# Altium project AUAV-X1_R1.PrjPCB
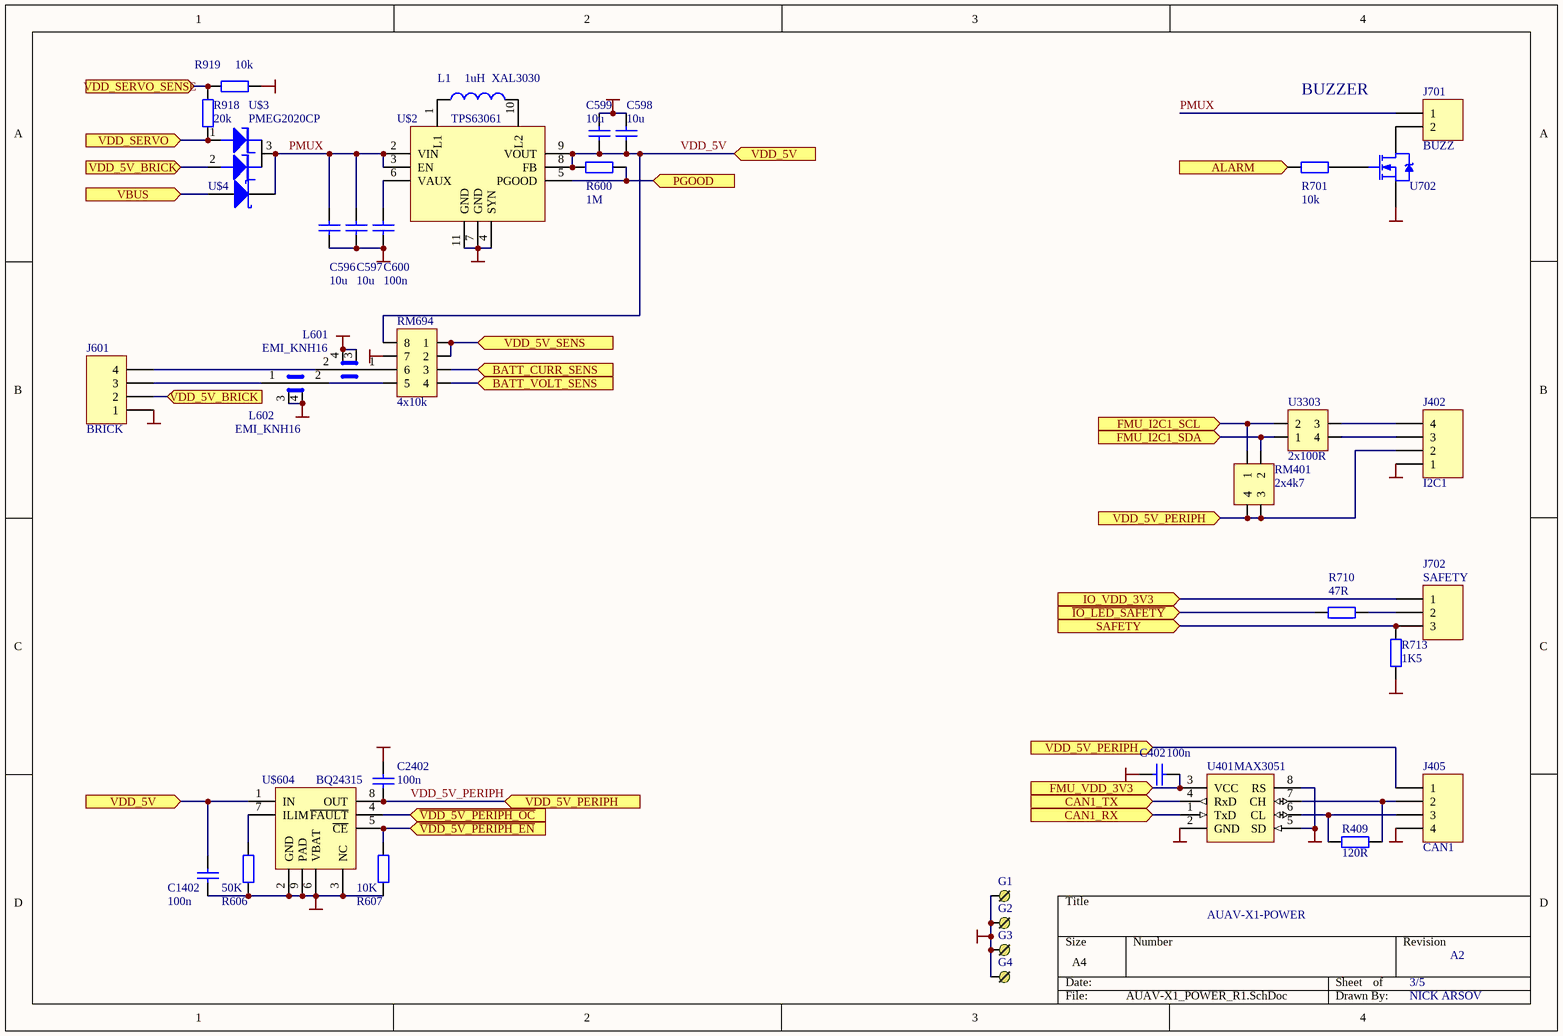
[diagram p0: AUAV-X1_POWER_R1.SchDoc]
3 sheets, 88 parts. Net scope: flat (ports and power ports of the same name join across sheets).
Board file: AUAV-X1_R1.PcbDoc
Sheets:
  AUAV-X1_POWER_R1.SchDoc
  AUAV-X1_IOSOC_R1.SchDoc
  AUAV-X1_SENSORS_R1.SchDoc

## Sheet AUAV-X1_POWER_R1.SchDoc
size A4; PageSetup: Record=PageOptions|CenterHorizontal=True|CenterVertical=True|PrintScale=0.97|XCorrection=1.00|YCorrection=1.00|PrintKind=2|BorderSize=5000000|LeftOffset=0|BottomOffset=0|Orientation=2|PaperLength=1000|PaperWidth=1000|Scale=100|PaperSource=267|PrintQuality=-4|MediaType=1|DitherType=1|PaperKind=A4|PrintScaleMode=1

### Parts
C402  100n  [0402A]
C596  10u  [0805A]
C597  10u  [0805A]
C598  10u  [0805A]
C599  10u  [0805A]
C600  100n  [0402A]
C1402  100n  [0402A]
C2402  100n  [0402A]
G1  PLUG  [SMT_PAD_ROUND]  (value not drawn)
G2  PLUG  [SMT_PAD_ROUND]  (value not drawn)
G3  PLUG  [SMT_PAD_ROUND]  (value not drawn)
G4  PLUG  [SMT_PAD_ROUND]  (value not drawn)
J402  I2C1  [HDR1X4]
J405  CAN1  [HDR1X4]
J601  BRICK  [HDR1X4]
J701  BUZZ  [HDR1X2]
J702  SAFETY  [HDR1X3]
L1  XAL3030  value 1uH  [XAL4040]
L601  EMI_KNH16  [EMI_KNH16_0603]
L602  EMI_KNH16  [EMI_KNH16_0603]
R409  120R  [0603A]
R600  1M  [0402A]
R606  50K  [0402A]
R607  10K  [0402A]
R701  10k  [0402A]
R710  47R  [0402A]
R713  1K5  [0402A]
R918  20k  [0402A]
R919  10k  [0402A]
RM401  2x4k7  [RM2_0804]
RM694  4x10k  [RM4_0804]
U401  MAX3051  [SOT-23-8]
U702  ZXMN2F34MA  [2N7002-SOT323]  (value not drawn)
U3303  2x100R  [RM2_0804]
U$2  TPS63061  [TPS63061]
U$3  PMEG2020CP  [pmeg2020cp]
U$4  D Schottky  [SOD323F]  (value not drawn)
U$604  BQ24315  [BQ24315]

### Ports
ALARM, BATT_CURR_SENS, BATT_VOLT_SENS, CAN1_RX, CAN1_TX, FMU_I2C1_SCL, FMU_I2C1_SDA, FMU_VDD_3V3, IO_VDD_3V3, PGOOD, SAFETY, VBUS, VDD_5V, VDD_5V_BRICK, VDD_5V_PERIPH, VDD_5V_SENS, VDD_SERVO, VDD_SERVO_SENSE, ~{IO_LED_SAFETY}, ~{VDD_5V_PERIPH_EN}, ~{VDD_5V_PERIPH_OC}

### Nets
GND: C402.1 C596.1 C597.1 C598.1 C599.1 C600.1 C1402.1 C2402.1 G1.1 G2.1 G3.1 G4.1 J402.1 J405.4 J601.1 L601.3(G) L601.4(G) L602.3(G) L602.4(G) R606.1 R607.1 R713.2 R919.2 RM694.7 U401.2(GND) U401.5(SD) U401.8(RS) U702.2(S) U$2.4(SYN) U$2.7(GND) U$2.11(GND) U$604.2(GND) U$604.3(NC) U$604.6(VBAT) U$604.9(PAD)
IO_VDD_3V3: J702.1 ; port IO_VDD_3V3
PMUX: C596.2 C597.2 J701.1 U$2.2(VIN) U$2.3(EN) U$3.3 U$4.2(K)
VDD_5V: C598.2 C599.2 C1402.2 R600.1 RM694.8 U$2.8(FB) U$2.9(VOUT) U$604.1(IN) ; port VDD_5V
VDD_5V_PERIPH: C2402.2 J402.2 J405.1 RM401.3 RM401.4 U$604.8(OUT) ; port VDD_5V_PERIPH
VDD_SERVO: R918.2 U$3.1 ; port VDD_SERVO
NetC402_2: C402.2 U401.3(VCC) ; port FMU_VDD_3V3
NetC600_2: C600.2 U$2.6(VAUX)
NetJ402_3: J402.3 U3303.4
NetJ402_4: J402.4 U3303.3
NetJ405_2: J405.2 R409.1 U401.7(CH)
NetJ405_3: J405.3 R409.2 U401.6(CL)
NetJ601_2: J601.2 U$3.2 ; port VDD_5V_BRICK
NetJ601_3: J601.3 L602.1(L1)
NetJ601_4: J601.4 L601.2(L2)
NetJ701_2: J701.2 U702.1(D)
NetJ702_2: J702.2 R710.1
NetJ702_3: J702.3 R713.1 ; port SAFETY
NetL1_1: L1.1 U$2.1(L1)
NetL1_2: L1.2 U$2.10(L2)
NetL601_1: L601.1(L1) RM694.6
NetL602_2: L602.2(L2) RM694.5
NetR600_2: R600.2 U$2.5(PGOOD) ; port PGOOD
NetR606_2: R606.2 U$604.7(ILIM)
NetR607_2: R607.2 U$604.5(~{CE}) ; port ~{VDD_5V_PERIPH_EN}
NetR701_1: R701.1 ; port ALARM
NetR701_2: R701.2 U702.3(G)
NetR710_2: R710.2 ; port ~{IO_LED_SAFETY}
NetR918_1: R918.1 R919.1 ; port VDD_SERVO_SENSE
NetRM401_1: RM401.1 U3303.2 ; port FMU_I2C1_SCL
NetRM401_2: RM401.2 U3303.1 ; port FMU_I2C1_SDA
NetRM694_1: RM694.1 RM694.2 ; port VDD_5V_SENS
NetRM694_3: RM694.3 ; port BATT_CURR_SENS
NetRM694_4: RM694.4 ; port BATT_VOLT_SENS
NetU401_1: U401.1(TxD) ; port CAN1_RX
NetU401_4: U401.4(RxD) ; port CAN1_TX
NetU$4_1: U$4.1(A) ; port VBUS
NetU$604_4: U$604.4(~{FAULT}) ; port ~{VDD_5V_PERIPH_OC}

### Notes on the sheet
- BUZZER
- AUAV-X1-POWER
- 3/5
- A2
- NICK ARSOV

### Library data of the parts
C402 C596-C600 C1402 C2402 = Cap: Capacitor; Value: 100pF; Published: 8-Jun-2000; LatestRevisionDate: 17-Jul-2002; LatestRevisionNote: Re-released for DXP Platform.; PackageReference: RAD-0.3; Publisher: Altium Limited
J402 J405 J601 = Header 4: Header, 4-Pin; LatestRevisionDate: 17-Jul-2002; LatestRevisionNote: Re-released for DXP Platform.; Publisher: Altium Limited
J701 = Header 2: Header, 2-Pin; LatestRevisionDate: 17-Jul-2002; LatestRevisionNote: Re-released for DXP Platform.; Publisher: Altium Limited
J702 = Header 3: Header, 3-Pin; LatestRevisionDate: 17-Jul-2002; LatestRevisionNote: Re-released for DXP Platform.; Publisher: Altium Limited
L1 = Inductor: Code_IEC: 1005; Published: 8-Jun-2000; LatestRevisionDate: 17-Jul-2002; LatestRevisionNote: Re-released for DXP Platform.; PackageReference: 0402-A; Publisher: Altium Limited; Code_JEITA: 0402
L601 L602 = EMI_KNH10
R409 R600 R606 R607 R701 R710 R713 R918 R919 = Res2: Resistor; Value: 1K; Published: 8-Jun-2000; LatestRevisionDate: 17-Jul-2002; LatestRevisionNote: Re-released for DXP Platform.; PackageReference: AXIAL-0.4; Publisher: Altium Limited
RM401 U3303 = RES_SMD_2
RM694 = RES_SMD_4
U702 = NMOS-2: N-Channel Power MOSFET; Note: Pin 2 is electrically connected to pin 4.; Published: 8-Jun-2000; LatestRevisionDate: 17-Jul-2002; LatestRevisionNote: Re-released for DXP Platform.; DatasheetDocument: PD-9.814; PackageReference: TO-220AB; Publisher: Altium Limited; Code_JEDEC: TO-220-AB; ComponentLink1Description: Manufacturer Link; ComponentLink1URL: http://www.irf.com/
U$4 = D Schottky: Schottky Diode; Published: 8-Jun-2000; LatestRevisionDate: 17-Jul-2002; LatestRevisionNote: Re-released for DXP Platform.; PackageReference: SMB; Publisher: Altium Limited; Code_JEDEC: DO-214-AA

## Sheet AUAV-X1_IOSOC_R1.SchDoc
size A4; PageSetup: Record=PageOptions|CenterHorizontal=True|CenterVertical=True|PrintScale=0.97|XCorrection=1.00|YCorrection=1.00|PrintKind=2|BorderSize=5000000|LeftOffset=0|BottomOffset=0|Orientation=2|PaperLength=1000|PaperWidth=1000|Scale=100|PaperSource=267|PrintQuality=-4|MediaType=1|DitherType=1|PaperKind=A4|PrintScaleMode=1
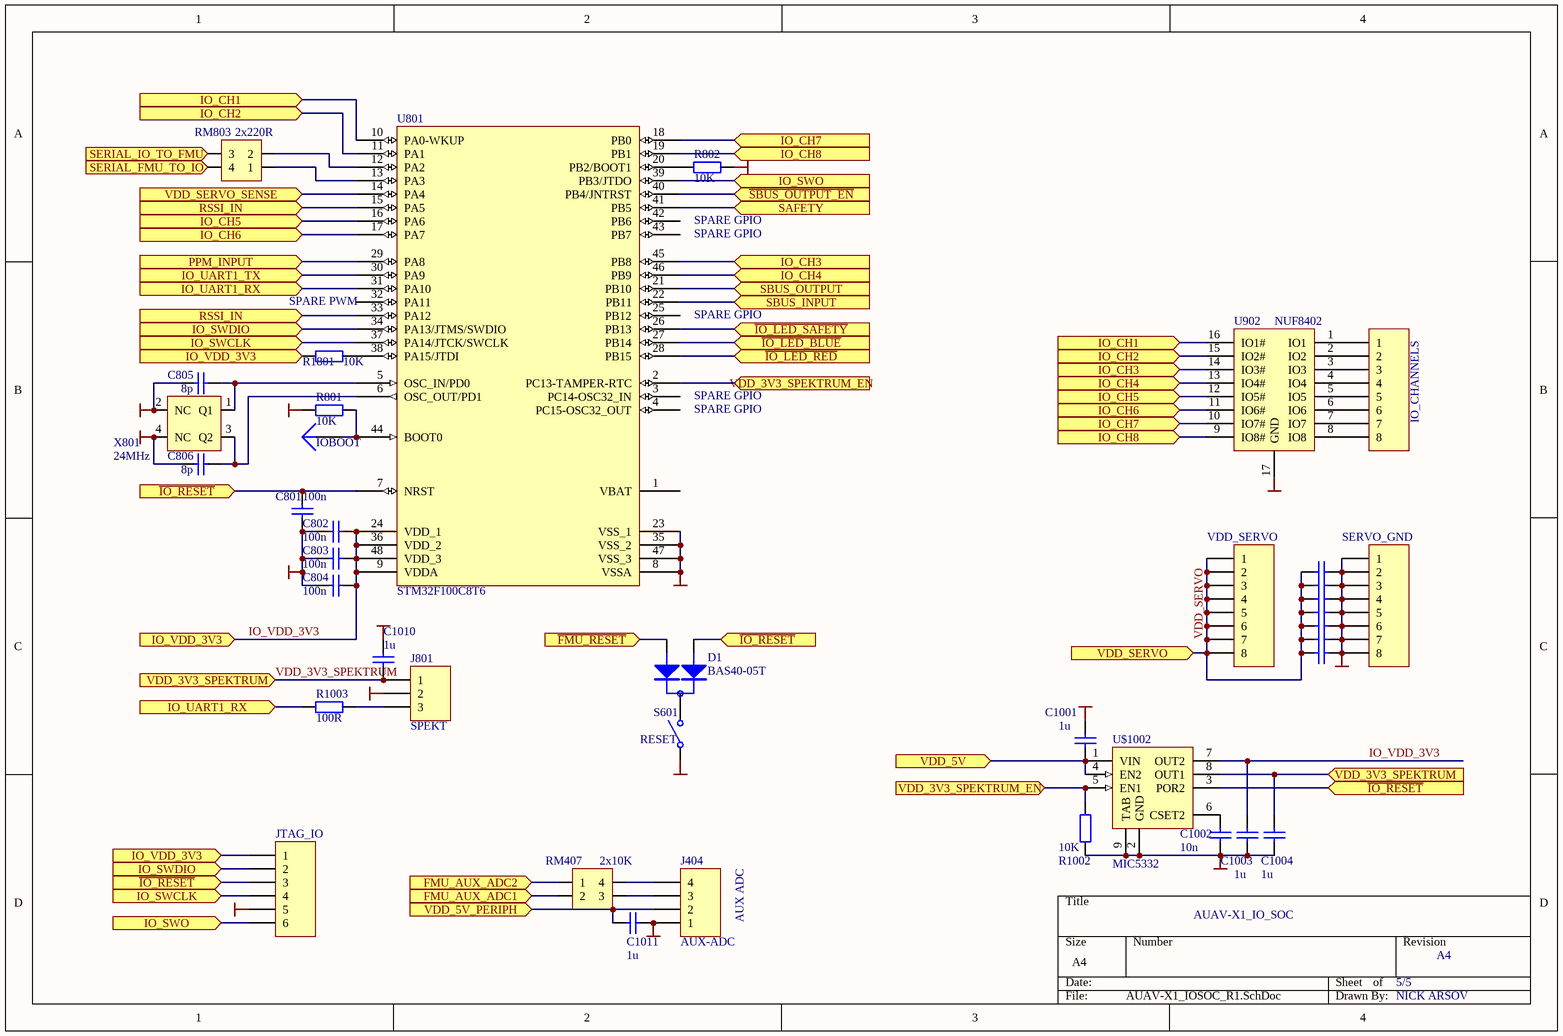
[diagram p1: AUAV-X1_IOSOC_R1.SchDoc]

### Parts
C801  100n  [0402A]
C802  100n  [0402A]
C803  100n  [0402A]
C804  100n  [0402A]
C805  8p  [0402A]
C806  8p  [0402A]
C1001  1u  [0402A]
C1002  10n  [0402A]
C1003  1u  [0402A]
C1004  1u  [0402A]
C1010  1u  [0402A]
C1011  1u  [0402A]
C3001  100n  [0402A]  (value not drawn)
C3002  100n  [0402A]  (value not drawn)
C3003  100n  [0402A]  (value not drawn)
C3004  100n  [0402A]  (value not drawn)
C3005  100n  [0402A]  (value not drawn)
C3006  100n  [0402A]  (value not drawn)
C3007  100n  [0402A]  (value not drawn)
D1  BAS40-05T  [SOT-523]
IO_CHANNELS  Header 8  [HDR1X8]  (value not drawn)
IOBOOT  Plug  [PAD1]  (value not drawn)
J404  AUX-ADC  [HDR1X4]
J801  SPEKT  [hdr1x3]
JTAG_IO  Header 6  [JTAG_TC2030]  (value not drawn)
R801  10K  [0402A]
R802  10K  [0402A]
R1002  10K  [0402A]
R1003  100R  [0402A]
R1801  10K  [0402A]
RM407  2x10K  [RM2_0804]
RM803  2x220R  [RM2_0804]
S601  RESET  [OMRON_B3U_V]
SERVO_GND  Header 8  [HDR1X8]  (value not drawn)
U801  STM32F100C8T6  [LQFP48_L]
U902  NUF8402  [NUF8402]
U$1002  MIC5332  [MIC5332]
VDD_SERVO  Header 8  [HDR1X8]  (value not drawn)
X801  24MHz  [Crystal_2.5x2]

### Ports
FMU_AUX_ADC1, FMU_AUX_ADC2, IO_CH1, IO_CH2, IO_CH3, IO_CH4, IO_CH5, IO_CH6, IO_CH7, IO_CH8, IO_SWCLK, IO_SWDIO, IO_SWO, IO_UART1_RX, IO_UART1_TX, IO_VDD_3V3, PPM_INPUT, RSSI_IN, SAFETY, SBUS_INPUT, SBUS_OUTPUT, SERIAL_FMU_TO_IO, SERIAL_IO_TO_FMU, VDD_3V3_SPEKTRUM, VDD_3V3_SPEKTRUM_EN, VDD_5V, VDD_5V_PERIPH, VDD_SERVO, VDD_SERVO_SENSE, ~{FMU_RESET}, ~{IO_LED_BLUE}, ~{IO_LED_RED}, ~{IO_LED_SAFETY}, ~{IO_RESET}, ~{SBUS_OUTPUT_EN}

### Nets
GND: C801.1 C802.1 C803.1 C804.1 C805.1 C806.1 C1001.2 C1002.1 C1003.1 C1004.1 C1010.2 C1011.2 C3001.1 C3002.1 C3003.1 C3004.1 C3005.1 C3006.1 C3007.1 J404.1 J801.2 JTAG_IO.5 R801.1 R802.2 R1002.1 S601.1(COMMON) SERVO_GND.1 SERVO_GND.2 SERVO_GND.3 SERVO_GND.4 SERVO_GND.5 SERVO_GND.6 SERVO_GND.7 SERVO_GND.8 U801.8(VSSA) U801.23(VSS_1) U801.35(VSS_2) U801.47(VSS_3) U902.17(GND) U$1002.2(GND) U$1002.9(TAB) X801.2(NC) X801.4(NC)
IO_VDD_3V3: C802.2 C803.2 C804.2 C1003.2 JTAG_IO.1 R1801.1 U801.9(VDDA) U801.24(VDD_1) U801.36(VDD_2) U801.48(VDD_3) U$1002.7(OUT2) ; port IO_VDD_3V3
VDD_3V3_SPEKTRUM: C1004.2 C1010.1 J801.1 U$1002.8(OUT1) ; port VDD_3V3_SPEKTRUM
VDD_5V: C1001.1 U$1002.1(VIN) U$1002.4(EN2) ; port VDD_5V
VDD_5V_PERIPH: C1011.1 J404.2 ; port VDD_5V_PERIPH
VDD_SERVO: C3001.2 C3002.2 C3003.2 C3004.2 C3005.2 C3006.2 C3007.2 VDD_SERVO.1 VDD_SERVO.2 VDD_SERVO.3 VDD_SERVO.4 VDD_SERVO.5 VDD_SERVO.6 VDD_SERVO.7 VDD_SERVO.8 ; port VDD_SERVO
NetC801_2: C801.2 D1.2 JTAG_IO.3 U801.7(NRST) U$1002.3(POR2) ; port ~{IO_RESET}
NetC805_2: C805.2 U801.5(OSC_IN/PD0) X801.1(Q1)
NetC806_2: C806.2 U801.6(OSC_OUT/PD1) X801.3(Q2)
NetC1002_2: C1002.2 U$1002.6(CSET2)
NetD1_1: D1.1 ; port ~{FMU_RESET}
NetD1_3: D1.3 S601.2(NO)
NetIO_CHANNELS_1: IO_CHANNELS.1 U902.1(IO1)
NetIO_CHANNELS_2: IO_CHANNELS.2 U902.2(IO2)
NetIO_CHANNELS_3: IO_CHANNELS.3 U902.3(IO3)
NetIO_CHANNELS_4: IO_CHANNELS.4 U902.4(IO4)
NetIO_CHANNELS_5: IO_CHANNELS.5 U902.5(IO5)
NetIO_CHANNELS_6: IO_CHANNELS.6 U902.6(IO6)
NetIO_CHANNELS_7: IO_CHANNELS.7 U902.7(IO7)
NetIO_CHANNELS_8: IO_CHANNELS.8 U902.8(IO8)
NetIOBOOT_1: IOBOOT.1 R801.2 U801.44(BOOT0)
NetJ404_3: J404.3 RM407.3
NetJ404_4: J404.4 RM407.4
NetJ702_3: U801.41(PB5) ; port SAFETY
NetJ801_3: J801.3 R1003.1
NetJTAG_IO_2: JTAG_IO.2 U801.34(PA13/JTMS/SWDIO) ; port IO_SWDIO
NetJTAG_IO_4: JTAG_IO.4 U801.37(PA14/JTCK/SWCLK) ; port IO_SWCLK
NetJTAG_IO_6: JTAG_IO.6 U801.39(PB3/JTDO) ; port IO_SWO
NetR703_2: U801.28(PB15) ; port ~{IO_LED_RED}
NetR705_2: U801.27(PB14) ; port ~{IO_LED_BLUE}
NetR710_2: U801.26(PB13) ; port ~{IO_LED_SAFETY}
NetR802_1: R802.1 U801.20(PB2/BOOT1)
NetR918_1: U801.14(PA4) ; port VDD_SERVO_SENSE
NetR1002_2: R1002.2 U801.2(PC13-TAMPER-RTC) U$1002.5(EN1) ; port VDD_3V3_SPEKTRUM_EN
NetR1003_2: R1003.2 U801.31(PA10) ; port IO_UART1_RX
NetR1801_2: R1801.2 U801.38(PA15/JTDI)
NetRM407_1: RM407.1 ; port FMU_AUX_ADC2
NetRM407_2: RM407.2 ; port FMU_AUX_ADC1
NetRM803_1: RM803.1 U801.13(PA3)
NetRM803_2: RM803.2 U801.12(PA2)
NetRM803_3: RM803.3 ; port SERIAL_IO_TO_FMU
NetRM803_4: RM803.4 ; port SERIAL_FMU_TO_IO
NetU801_10: U801.10(PA0-WKUP) U902.16(IO1#) ; port IO_CH1
NetU801_11: U801.11(PA1) U902.15(IO2#) ; port IO_CH2
NetU801_15: U801.15(PA5) U801.33(PA12) ; port RSSI_IN
NetU801_16: U801.16(PA6) U902.12(IO5#) ; port IO_CH5
NetU801_17: U801.17(PA7) U902.11(IO6#) ; port IO_CH6
NetU801_18: U801.18(PB0) U902.10(IO7#) ; port IO_CH7
NetU801_19: U801.19(PB1) U902.9(IO8#) ; port IO_CH8
NetU801_21: U801.21(PB10) ; port SBUS_OUTPUT
NetU801_22: U801.22(PB11) ; port SBUS_INPUT
NetU801_29: U801.29(PA8) ; port PPM_INPUT
NetU801_30: U801.30(PA9) ; port IO_UART1_TX
NetU801_40: U801.40(PB4/JNTRST) ; port ~{SBUS_OUTPUT_EN}
NetU801_45: U801.45(PB8) U902.14(IO3#) ; port IO_CH3
NetU801_46: U801.46(PB9) U902.13(IO4#) ; port IO_CH4

Not connected (* = marked no-connect by the designer): U801 1(VBAT) 3(PC14-OSC32_IN) 4(PC15-OSC32_OUT) 25(PB12) 32(PA11) 42(PB6) 43(PB7)

### Notes on the sheet
- SPARE GPIO
- SPARE PWM
- AUX ADC
- AUAV-X1_IO_SOC
- 5/5
- A4
- NICK ARSOV

### Library data of the parts
C801-C806 C1001-C1004 C1010 C1011 C3001-C3007 = Cap: Capacitor; Value: 100pF; Published: 8-Jun-2000; LatestRevisionDate: 17-Jul-2002; LatestRevisionNote: Re-released for DXP Platform.; PackageReference: RAD-0.3; Publisher: Altium Limited
D1 = D-DIODE
IO_CHANNELS SERVO_GND VDD_SERVO = Header 8: Header, 8-Pin; LatestRevisionDate: 17-Jul-2002; LatestRevisionNote: Re-released for DXP Platform.; Publisher: Altium Limited
J404 = Header 4: Header, 4-Pin; LatestRevisionDate: 17-Jul-2002; LatestRevisionNote: Re-released for DXP Platform.; Publisher: Altium Limited
J801 = Header 3: Header, 3-Pin; LatestRevisionDate: 17-Jul-2002; LatestRevisionNote: Re-released for DXP Platform.; Publisher: Altium Limited
JTAG_IO = Header 6: Header, 6-Pin; LatestRevisionDate: 17-Jul-2002; LatestRevisionNote: Re-released for DXP Platform.; Publisher: Altium Limited
R801 R802 R1002 R1003 R1801 = Res2: Resistor; Value: 1K; Published: 8-Jun-2000; LatestRevisionDate: 17-Jul-2002; LatestRevisionNote: Re-released for DXP Platform.; PackageReference: AXIAL-0.4; Publisher: Altium Limited
RM407 RM803 = RES_SMD_2
S601 = SW-SPST: Single-Pole, Single-Throw Switch; Published: 24-Mar-1999; LatestRevisionDate: 17-Jul-2002; LatestRevisionNote: Re-released for DXP Platform.; PackageReference: SPST-2; Publisher: Altium Limited
U801 = STM32F101C6T6: STM32 ARM-based 32-bit MCU with 32 Kbytes Flash, 48-pin LQFP, Industrial Temperature; Published: 30-May-2008; DatasheetVersion: rev6, Mar-2008; PackageVersion: Mar-2008; PackageReference: LQFP48; Publisher: Altium Limited; PackageDescription: 48-Pin Low-Profile Quad Flat Pack, 7 x 7 mm Body, 0.5 mm Pitch (LQFP48); ComponentLink1Description: Manufacturer Link; ComponentLink1URL: www.st.com/stm32; ComponentLink2Description: Datasheet; ComponentLink2URL: http://www.st.com/stonline/products/literature/ds/13586.pdf
X801 = Crystal_4pin
IOBOOT = Plug: LatestRevisionDate: 17-Jul-2002; LatestRevisionNote: Re-released for DXP Platform.; Publisher: Altium Limited

## Sheet AUAV-X1_SENSORS_R1.SchDoc
size A4; PageSetup: Record=PageOptions|CenterHorizontal=True|CenterVertical=True|PrintScale=0.97|XCorrection=1.00|YCorrection=1.00|PrintKind=2|BorderSize=5000000|LeftOffset=0|BottomOffset=0|Orientation=2|PaperLength=1000|PaperWidth=1000|Scale=100|PaperSource=267|PrintQuality=-4|MediaType=1|DitherType=1|PaperKind=A4|PrintScaleMode=1
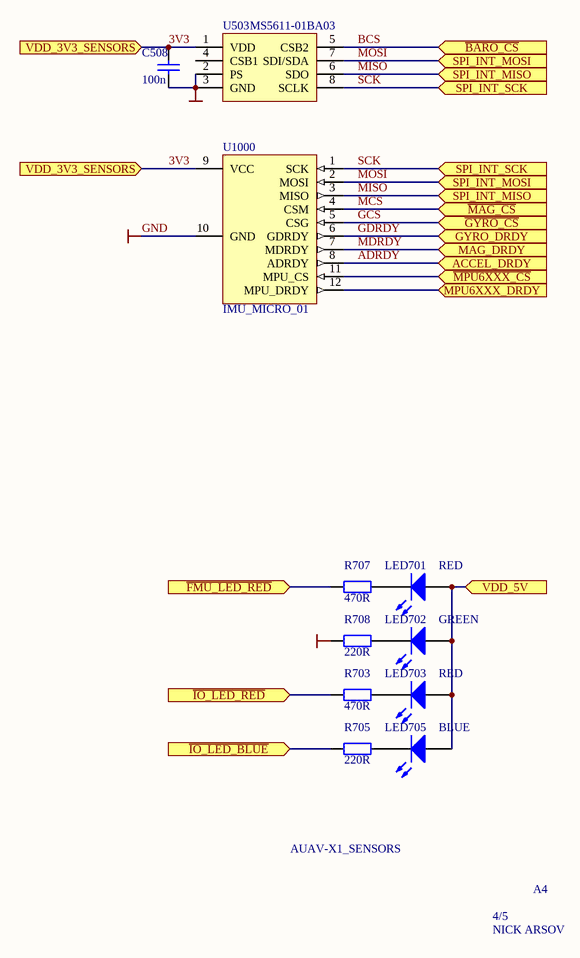
[diagram p2: AUAV-X1_SENSORS_R1.SchDoc]

### Parts
C508  100n  [0402A]
LED701  RED  [0603A]
LED702  GREEN  [0603A]
LED703  RED  [0603A]
LED705  BLUE  [0603A]
R703  470R  [0603A]
R705  220R  [0603A]
R707  470R  [0603A]
R708  220R  [0603A]
U503  MS5611-01BA03  [MS5611]
U1000  IMU_MICRO_01  [MicroIMU_01]

### Ports
ACCEL_DRDY, GYRO_DRDY, MAG_DRDY, MPU6XXX_DRDY, SPI_INT_MISO, SPI_INT_MOSI, SPI_INT_SCK, VDD_3V3_SENSORS, VDD_5V, ~{BARO_CS}, ~{FMU_LED_RED}, ~{GYRO_CS}, ~{IO_LED_BLUE}, ~{IO_LED_RED}, ~{MAG_CS}, ~{MPU6XXX_CS}

### Nets
GND: C508.1 R708.2 U503.2(PS) U503.3(GND) U1000.10(GND)
3V3: C508.2 U503.1(VDD) U1000.9(VCC) ; port VDD_3V3_SENSORS
ADRDY: U1000.8(ADRDY) ; port ACCEL_DRDY
BCS: U503.5(CSB2) ; port ~{BARO_CS}
GCS: U1000.5(CSG) ; port ~{GYRO_CS}
GDRDY: U1000.6(GDRDY) ; port GYRO_DRDY
MCS: U1000.4(CSM) ; port ~{MAG_CS}
MDRDY: U1000.7(MDRDY) ; port MAG_DRDY
MISO: U503.6(SDO) U1000.3(MISO) ; port SPI_INT_MISO
MOSI: U503.7(SDI/SDA) U1000.2(MOSI) ; port SPI_INT_MOSI
SCK: U503.8(SCLK) U1000.1(SCK) ; port SPI_INT_SCK
VDD_5V: LED701.1(A) LED702.1(A) LED703.1(A) LED705.1(A) ; port VDD_5V
NetLED701_2: LED701.2(K) R707.1
NetLED702_2: LED702.2(K) R708.1
NetLED703_2: LED703.2(K) R703.1
NetLED705_2: LED705.2(K) R705.1
NetR703_2: R703.2 ; port ~{IO_LED_RED}
NetR705_2: R705.2 ; port ~{IO_LED_BLUE}
NetR707_2: R707.2 ; port ~{FMU_LED_RED}
NetU1000_11: U1000.11(MPU_CS) ; port ~{MPU6XXX_CS}
NetU1000_12: U1000.12(MPU_DRDY) ; port MPU6XXX_DRDY

Not connected (* = marked no-connect by the designer): U503 4(CSB1)

### Notes on the sheet
- AUAV-X1_SENSORS
- 4/5
- A4
- NICK ARSOV

### Library data of the parts
C508 = Cap: Capacitor; Value: 100pF; Published: 8-Jun-2000; LatestRevisionDate: 17-Jul-2002; LatestRevisionNote: Re-released for DXP Platform.; PackageReference: RAD-0.3; Publisher: Altium Limited
LED701-LED703 LED705 = LED0: Typical INFRARED GaAs LED; Published: 8-Jun-2000; LatestRevisionDate: 08-Jul-2005; LatestRevisionNote: Mech Layer 1 removed.; PackageReference: LED-0; Publisher: Altium Limited
R703 R705 R707 R708 = Res2: Resistor; Value: 1K; Published: 8-Jun-2000; LatestRevisionDate: 17-Jul-2002; LatestRevisionNote: Re-released for DXP Platform.; PackageReference: AXIAL-0.4; Publisher: Altium Limited

## Nets that join several sheets
GND: AUAV-X1_POWER_R1 (35 pins), AUAV-X1_IOSOC_R1 (43 pins), AUAV-X1_SENSORS_R1 (5 pins)
IO_VDD_3V3: AUAV-X1_POWER_R1 (J702.1), AUAV-X1_IOSOC_R1 (11 pins)
NetJ702_3: AUAV-X1_POWER_R1 (J702.3 R713.1), AUAV-X1_IOSOC_R1 (U801.41)
NetR703_2: AUAV-X1_IOSOC_R1 (U801.28), AUAV-X1_SENSORS_R1 (R703.2)
NetR705_2: AUAV-X1_IOSOC_R1 (U801.27), AUAV-X1_SENSORS_R1 (R705.2)
NetR710_2: AUAV-X1_POWER_R1 (R710.2), AUAV-X1_IOSOC_R1 (U801.26)
NetR918_1: AUAV-X1_POWER_R1 (R918.1 R919.1), AUAV-X1_IOSOC_R1 (U801.14)
VDD_5V: AUAV-X1_POWER_R1 (8 pins), AUAV-X1_IOSOC_R1 (C1001.1 U$1002.1 U$1002.4), AUAV-X1_SENSORS_R1 (LED701.1 LED702.1 LED703.1 LED705.1)
VDD_5V_PERIPH: AUAV-X1_POWER_R1 (6 pins), AUAV-X1_IOSOC_R1 (C1011.1 J404.2)
VDD_SERVO: AUAV-X1_POWER_R1 (R918.2 U$3.1), AUAV-X1_IOSOC_R1 (15 pins)